# Altium project PCB_Project1.PrjPCB
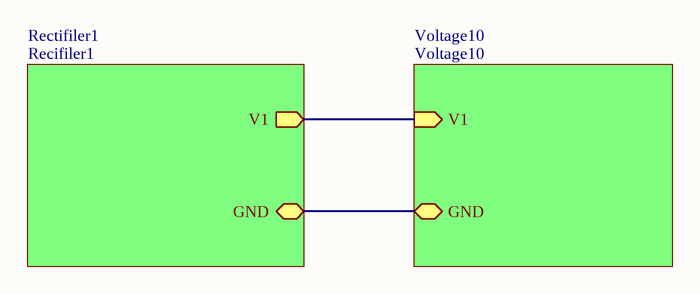
[diagram p0: power1.SchDoc]
3 sheets, 12 parts. Net scope: hierarchical (ports join the sheet entries above them; power ports are global).
Sheets:
  power1.SchDoc
    Rectifiler1 = Recifiler1.SchDoc
    Voltage10 = Voltage10.SchDoc

## Sheet power1.SchDoc
size A4

### Sub-sheets
Rectifiler1 = Recifiler1: V1 (out), GND (bidir)
Voltage10 = Voltage10: V1 (in), GND (bidir)

### Nets
GND: sheet Rectifiler1/GND, sheet Voltage10/GND
NetC1_1: sheet Rectifiler1/V1, sheet Voltage10/V1

## Sheet Recifiler1.SchDoc
size A4
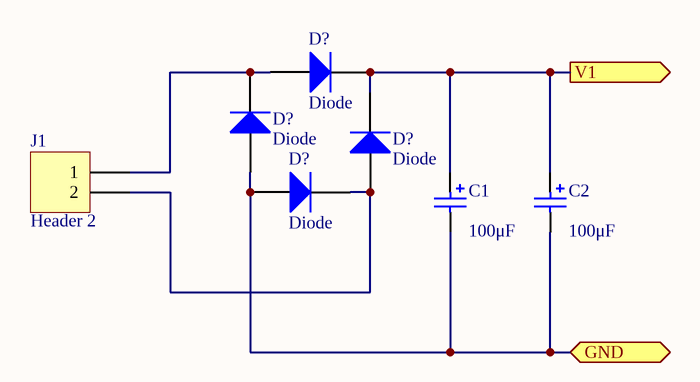
[diagram p1: Recifiler1.SchDoc]

### Parts
(Parts that share a designator on the sheet are numbered #1, #2 ... from top to bottom, then left to right.)
C1  value 100μF  [POLAR0.8]  (hidden comment: Cap Pol2)
C2#1  value 100μF  [POLAR0.8]  (hidden comment: Cap Pol2)
D?#1  Diode  [DSO-C2/X3.3]
D?#2  Diode  [DSO-C2/X3.3]
D?#3  Diode  [DSO-C2/X3.3]
D?#4  Diode  [DSO-C2/X3.3]
J1  Header 2  [HDR1X2]

### Ports
GND (bidir), V1 (out)

### Nets
GND: C1.2 C2#1.2 D?#2.1(A) D?#4.1(A) ; port GND
NetC1_1: C1.1 C2#1.1 D?#1.2(K) D?#3.2(K) ; port V1
NetD?#1_1: D?#1.1(A) D?#2.2(K) J1.1
NetD?#3_1: D?#3.1(A) D?#4.2(K) J1.2

### Library data of the parts
C1 C2#1 = Cap Pol2: Polarized Capacitor (Axial); Published: 8-Jun-2000; LatestRevisionDate: 17-Jul-2002; LatestRevisionNote: Re-released for DXP Platform.; PackageReference: POLAR0.8; Publisher: Altium Limited
D?#1-D?#4 = Diode: Default Diode; Published: 8-Jun-2000; LatestRevisionDate: 17-Jul-2002; LatestRevisionNote: Re-released for DXP Platform.; PackageVersion: Sep-1996; PackageReference: SMC; Publisher: Altium Limited; Code_JEDEC: DO-214-AB
J1 = Header 2: Header, 2-Pin; LatestRevisionDate: 17-Jul-2002; LatestRevisionNote: Re-released for DXP Platform.; Publisher: Altium Limited

## Sheet Voltage10.SchDoc
size A4
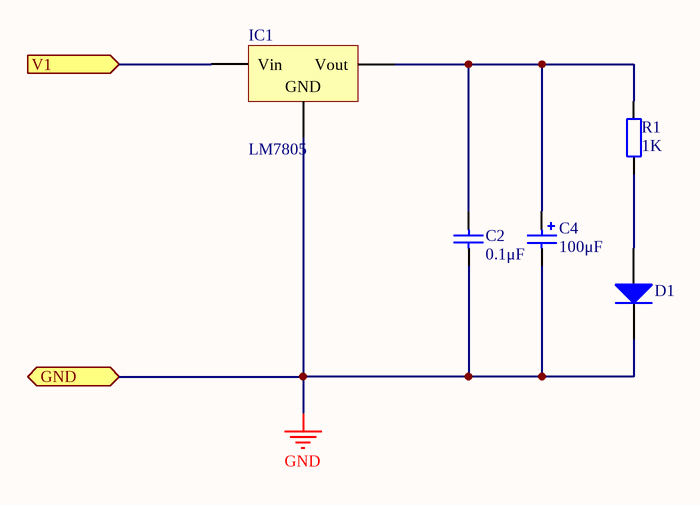
[diagram p2: Voltage10.SchDoc]

### Parts
(Parts that share a designator on the sheet are numbered #1, #2 ... from top to bottom, then left to right.)
C2#2  value 0.1μF  [RAD-0.3]  (hidden comment: Cap)
C4  value 100μF  [POLAR0.8]  (hidden comment: Cap Pol2)
D1  Diode  [DSO-C2/X3.3]  (value not drawn)
IC1  LM7805  [TO254P1510-3_4L]
R1  value 1K  [AXIAL-0.4]  (hidden comment: Res2)

### Ports
GND (bidir), V1 (in)

### Nets
GND: C2#2.1 C4.2 D1.2(K) IC1.2(GND) ; port GND
NetC1_1: IC1.1(Vin) ; port V1
NetC2#2_2: C2#2.2 C4.1 IC1.3(Vout) R1.2
NetD1_1: D1.1(A) R1.1

### Library data of the parts
C2#2 = Cap: Capacitor; Published: 8-Jun-2000; LatestRevisionDate: 17-Jul-2002; LatestRevisionNote: Re-released for DXP Platform.; PackageReference: RAD-0.3; Publisher: Altium Limited
C4 = Cap Pol2: Polarized Capacitor (Axial); Published: 8-Jun-2000; LatestRevisionDate: 17-Jul-2002; LatestRevisionNote: Re-released for DXP Platform.; PackageReference: POLAR0.8; Publisher: Altium Limited
D1 = Diode: Default Diode; Published: 8-Jun-2000; LatestRevisionDate: 17-Jul-2002; LatestRevisionNote: Re-released for DXP Platform.; PackageVersion: Sep-1996; PackageReference: SMC; Publisher: Altium Limited; Code_JEDEC: DO-214-AB
IC1 = Volt Reg: Voltage Regulator; Published: 24-Mar-1999; LatestRevisionDate: 29-May-2009; LatestRevisionNote: IPC-7351 Footprint Added.; PackageReference: D2PAK; Publisher: Altium Limited; PackageDescription: 3-Pin Transistor Outline Package 2.54 mm Pitch, 15.1 mm Lead Span
R1 = Res2: Resistor; Published: 8-Jun-2000; LatestRevisionDate: 17-Jul-2002; LatestRevisionNote: Re-released for DXP Platform.; PackageReference: AXIAL-0.4; Publisher: Altium Limited

## Nets that join several sheets
GND: Recifiler1 (C1.2 C2#1.2 D?#2.1 D?#4.1), Voltage10 (C2#2.1 C4.2 D1.2 IC1.2)
NetC1_1: Recifiler1 (C1.1 C2#1.1 D?#1.2 D?#3.2), Voltage10 (IC1.1)